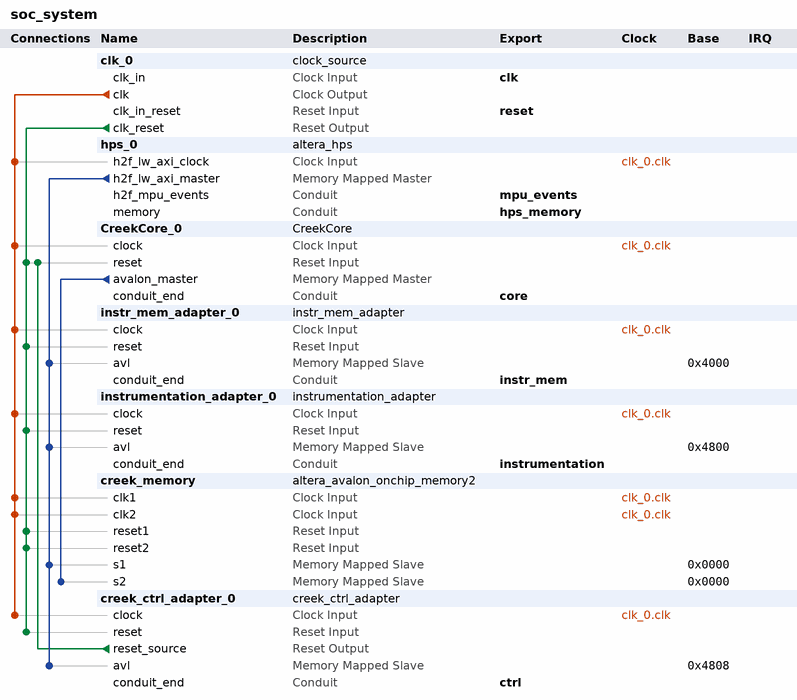
[diagram p0: system contents]
# Platform Designer (Qsys) system soc_system, Cyclone V 5CSXFC6D6F31C8ES
# Parameters at their usual value, and those the tool derives, are not listed.
package require -exact qsys 13.1
create_system soc_system
set_project_property DEVICE_FAMILY {Cyclone V}
set_project_property DEVICE 5CSXFC6D6F31C8ES

add_instance clk_0 clock_source 13.1
set_instance_parameter_value clk_0 clockFrequency 50000000

add_instance hps_0 altera_hps 13.1
set_instance_parameter_value hps_0 MEM_VENDOR JEDEC
set_instance_parameter_value hps_0 MEM_CLK_FREQ_MAX 400.0
set_instance_parameter_value hps_0 MEM_ROW_ADDR_WIDTH 15
set_instance_parameter_value hps_0 MEM_COL_ADDR_WIDTH 10
set_instance_parameter_value hps_0 MEM_DQ_WIDTH 32
set_instance_parameter_value hps_0 MEM_BANKADDR_WIDTH 3
set_instance_parameter_value hps_0 MEM_DRV_STR RZQ/6
set_instance_parameter_value hps_0 MEM_RTT_NOM RZQ/6
set_instance_parameter_value hps_0 MEM_RTT_WR {Dynamic ODT off}
set_instance_parameter_value hps_0 MEM_WTCL 6
set_instance_parameter_value hps_0 MEM_TCL 7
set_instance_parameter_value hps_0 TIMING_TIS 175
set_instance_parameter_value hps_0 TIMING_TIH 250
set_instance_parameter_value hps_0 TIMING_TDS 50
set_instance_parameter_value hps_0 TIMING_TDH 125
set_instance_parameter_value hps_0 TIMING_TDQSQ 120
set_instance_parameter_value hps_0 TIMING_TDQSCK 400
set_instance_parameter_value hps_0 TIMING_TQSH 0.38
set_instance_parameter_value hps_0 MEM_TINIT_US 499
set_instance_parameter_value hps_0 MEM_TMRD_CK 3
set_instance_parameter_value hps_0 MEM_TRAS_NS 40.0
set_instance_parameter_value hps_0 MEM_TRCD_NS 15.0
set_instance_parameter_value hps_0 MEM_TRP_NS 15.0
set_instance_parameter_value hps_0 MEM_TREFI_US 7.0
set_instance_parameter_value hps_0 MEM_TRFC_NS 75.0
set_instance_parameter_value hps_0 MEM_TWTR 2
set_instance_parameter_value hps_0 MEM_TFAW_NS 37.5
set_instance_parameter_value hps_0 REF_CLK_FREQ 25.0
set_instance_parameter_value hps_0 DEFAULT_FAST_SIM_MODEL true
set_instance_parameter_value hps_0 TIMING_BOARD_MAX_CK_DELAY 0.6
set_instance_parameter_value hps_0 TIMING_BOARD_MAX_DQS_DELAY 0.6
set_instance_parameter_value hps_0 TIMING_BOARD_SKEW_CKDQS_DIMM_MIN -0.01
set_instance_parameter_value hps_0 TIMING_BOARD_SKEW_CKDQS_DIMM_MAX 0.01
set_instance_parameter_value hps_0 TIMING_BOARD_SKEW_WITHIN_DQS 0.02
set_instance_parameter_value hps_0 TIMING_BOARD_SKEW_BETWEEN_DQS 0.02
set_instance_parameter_value hps_0 TIMING_BOARD_DQ_TO_DQS_SKEW 0.0
set_instance_parameter_value hps_0 TIMING_BOARD_AC_SKEW 0.02
set_instance_parameter_value hps_0 TIMING_BOARD_AC_TO_CK_SKEW 0.0
set_instance_parameter_value hps_0 MEM_CLK_FREQ 400.0
set_instance_parameter_value hps_0 HPS_PROTOCOL DDR3
set_instance_parameter_value hps_0 MPU_EVENTS_Enable true
set_instance_parameter_value hps_0 STM_Enable false
set_instance_parameter_value hps_0 F2S_Width 0
set_instance_parameter_value hps_0 S2F_Width 0
set_instance_parameter_value hps_0 LWH2F_Enable true
set_instance_parameter_value hps_0 F2SCLK_DBGRST_Enable false
set_instance_parameter_value hps_0 F2SCLK_WARMRST_Enable false
set_instance_parameter_value hps_0 F2SCLK_COLDRST_Enable false
set_instance_parameter_value hps_0 F2SINTERRUPT_Enable false
set_instance_parameter_value hps_0 EMAC1_PinMuxing Unused
set_instance_parameter_value hps_0 EMAC1_Mode N/A
set_instance_parameter_value hps_0 QSPI_PinMuxing Unused
set_instance_parameter_value hps_0 QSPI_Mode N/A
set_instance_parameter_value hps_0 SDIO_PinMuxing Unused
set_instance_parameter_value hps_0 SDIO_Mode N/A
set_instance_parameter_value hps_0 USB1_PinMuxing Unused
set_instance_parameter_value hps_0 USB1_Mode N/A
set_instance_parameter_value hps_0 SPIM1_PinMuxing Unused
set_instance_parameter_value hps_0 SPIM1_Mode N/A
set_instance_parameter_value hps_0 UART0_PinMuxing Unused
set_instance_parameter_value hps_0 UART0_Mode N/A
set_instance_parameter_value hps_0 I2C0_PinMuxing Unused
set_instance_parameter_value hps_0 I2C0_Mode N/A
set_instance_parameter_value hps_0 I2C1_PinMuxing Unused
set_instance_parameter_value hps_0 I2C1_Mode N/A
set_instance_parameter_value hps_0 S2FCLK_USER1CLK_FREQ 100
set_instance_parameter_value hps_0 FPGA_PERIPHERAL_OUTPUT_CLOCK_FREQ_EMAC0_MD_CLK 100
set_instance_parameter_value hps_0 FPGA_PERIPHERAL_OUTPUT_CLOCK_FREQ_EMAC0_GTX_CLK 100
set_instance_parameter_value hps_0 FPGA_PERIPHERAL_OUTPUT_CLOCK_FREQ_EMAC1_MD_CLK 100
set_instance_parameter_value hps_0 FPGA_PERIPHERAL_OUTPUT_CLOCK_FREQ_EMAC1_GTX_CLK 100

add_instance CreekCore_0 CreekCore 1.0

add_instance instr_mem_adapter_0 instr_mem_adapter 1.0

add_instance instrumentation_adapter_0 instrumentation_adapter 1.0

add_instance creek_memory altera_avalon_onchip_memory2 13.1
set_instance_parameter_value creek_memory dataWidth 128
set_instance_parameter_value creek_memory dualPort true
set_instance_parameter_value creek_memory initMemContent true
set_instance_parameter_value creek_memory initializationFileName onchip_mem.hex
set_instance_parameter_value creek_memory memorySize 16384

add_instance creek_ctrl_adapter_0 creek_ctrl_adapter 1.0

# connections
add_connection clk_0.clk creek_ctrl_adapter_0.clock clock
add_connection clk_0.clk creek_memory.clk1 clock
add_connection clk_0.clk creek_memory.clk2 clock
add_connection clk_0.clk CreekCore_0.clock clock
add_connection clk_0.clk hps_0.h2f_lw_axi_clock clock
add_connection clk_0.clk instr_mem_adapter_0.clock clock
add_connection clk_0.clk instrumentation_adapter_0.clock clock
add_connection clk_0.clk_reset creek_ctrl_adapter_0.reset reset
add_connection clk_0.clk_reset creek_memory.reset1 reset
add_connection clk_0.clk_reset creek_memory.reset2 reset
add_connection clk_0.clk_reset CreekCore_0.reset reset
add_connection clk_0.clk_reset instr_mem_adapter_0.reset reset
add_connection clk_0.clk_reset instrumentation_adapter_0.reset reset
add_connection creek_ctrl_adapter_0.reset_source CreekCore_0.reset reset
add_connection CreekCore_0.avalon_master creek_memory.s2 avalon
set_connection_parameter_value CreekCore_0.avalon_master/creek_memory.s2 baseAddress 0x0000
add_connection hps_0.h2f_lw_axi_master creek_ctrl_adapter_0.avl avalon
set_connection_parameter_value hps_0.h2f_lw_axi_master/creek_ctrl_adapter_0.avl baseAddress 0x4808
add_connection hps_0.h2f_lw_axi_master creek_memory.s1 avalon
set_connection_parameter_value hps_0.h2f_lw_axi_master/creek_memory.s1 baseAddress 0x0000
add_connection hps_0.h2f_lw_axi_master instr_mem_adapter_0.avl avalon
set_connection_parameter_value hps_0.h2f_lw_axi_master/instr_mem_adapter_0.avl baseAddress 0x4000
add_connection hps_0.h2f_lw_axi_master instrumentation_adapter_0.avl avalon
set_connection_parameter_value hps_0.h2f_lw_axi_master/instrumentation_adapter_0.avl baseAddress 0x4800

# exported interfaces
add_interface clk clock sink
set_interface_property clk EXPORT_OF clk_0.clk_in
add_interface reset reset sink
set_interface_property reset EXPORT_OF clk_0.clk_in_reset
add_interface hps_memory conduit end
set_interface_property hps_memory EXPORT_OF hps_0.memory
add_interface core conduit end
set_interface_property core EXPORT_OF CreekCore_0.conduit_end
add_interface instr_mem conduit end
set_interface_property instr_mem EXPORT_OF instr_mem_adapter_0.conduit_end
add_interface instrumentation conduit end
set_interface_property instrumentation EXPORT_OF instrumentation_adapter_0.conduit_end
add_interface mpu_events conduit end
set_interface_property mpu_events EXPORT_OF hps_0.h2f_mpu_events
add_interface ctrl conduit end
set_interface_property ctrl EXPORT_OF creek_ctrl_adapter_0.conduit_end

set_interconnect_requirement {$system} qsys_mm.clockCrossingAdapter HANDSHAKE
set_interconnect_requirement {$system} qsys_mm.maxAdditionalLatency 1
set_interconnect_requirement {$system} qsys_mm.insertDefaultSlave false

save_system soc_system.qsys
